# EAGLE schematic BpodMainBoard_r0_5 (EAGLE 6.3)
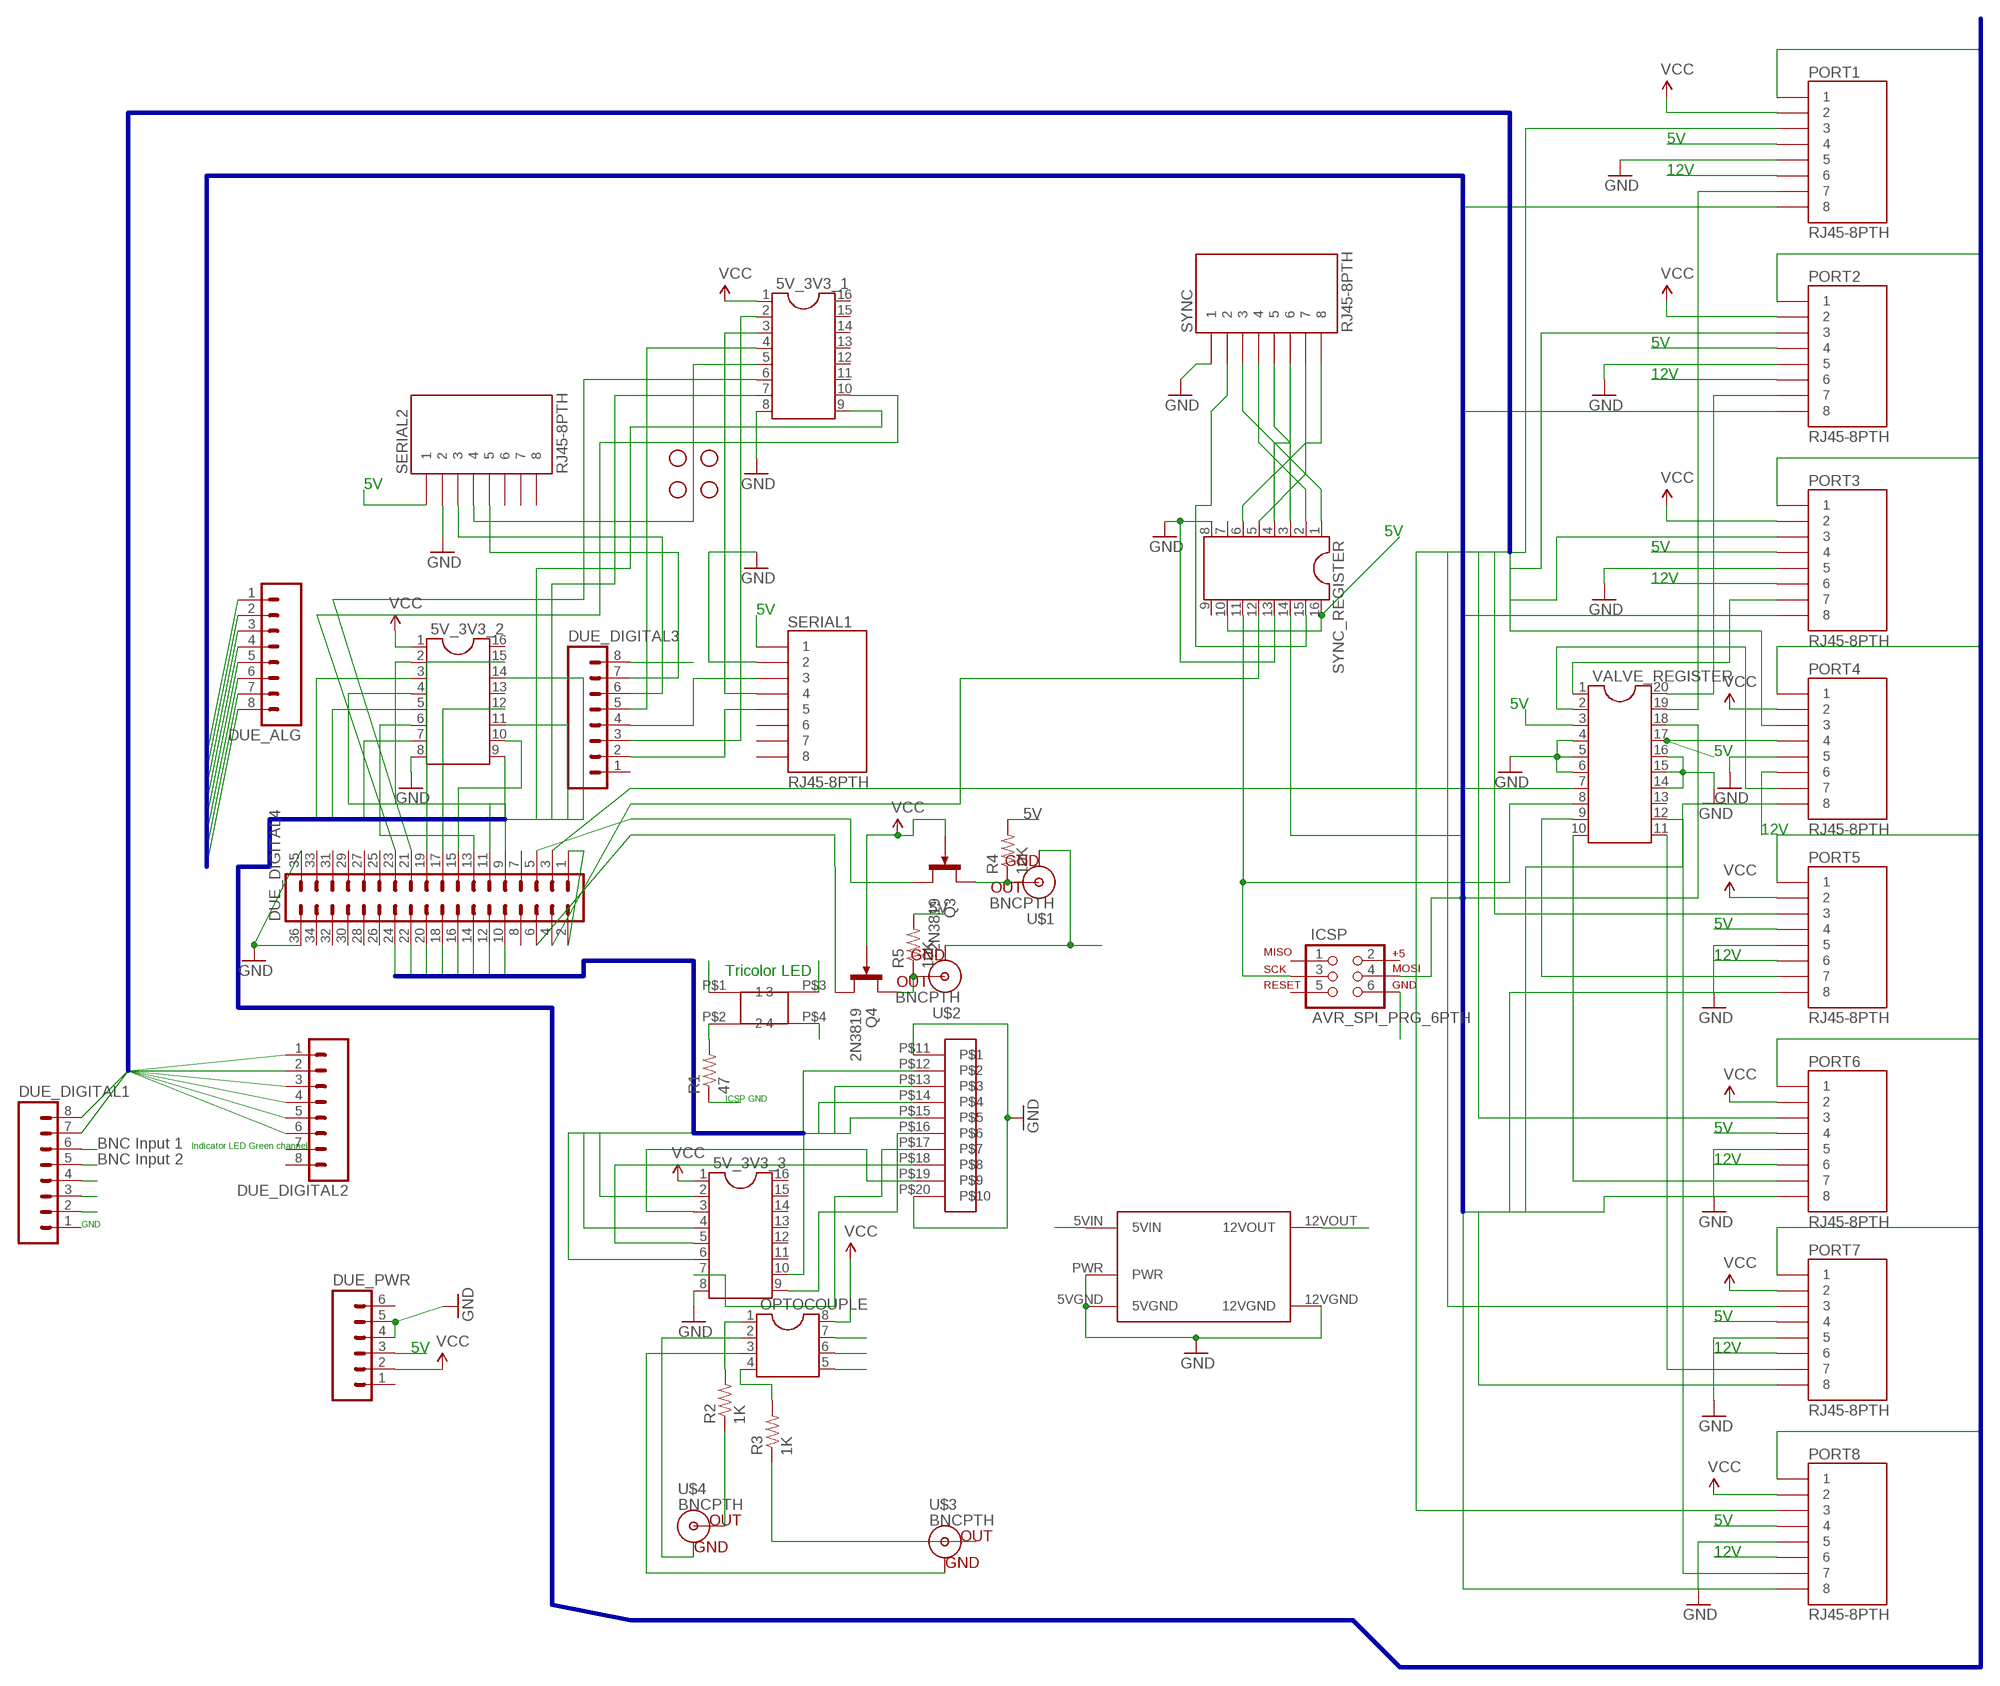
[diagram p0: schematic, sheet 1]

## Parts
5V_3V3_1  DIL16  [DIL16]
5V_3V3_2  DIL16  [DIL16]
5V_3V3_3  DIL16  [DIL16]
DUE_ALG  M081X08  [1X08]
DUE_DIGITAL1  M081X08  [1X08]
DUE_DIGITAL2  M081X08  [1X08]
DUE_DIGITAL3  M081X08  [1X08]
DUE_DIGITAL4  MA18-2  [MA18-2]
DUE_PWR  M06SIP  [1X06]
ICSP  AVR_SPI_PRG_6PTH  [2X3]
JP1  STAND-OFF  [STAND-OFF]
JP2  STAND-OFF  [STAND-OFF]
JP3  STAND-OFF  [STAND-OFF]
JP4  STAND-OFF  [STAND-OFF]
OPTOCOUPLE  DIL8  [DIL08]
PORT1  RJ45-8PTH  [RJ45-8]
PORT2  RJ45-8PTH  [RJ45-8]
PORT3  RJ45-8PTH  [RJ45-8]
PORT4  RJ45-8PTH  [RJ45-8]
PORT5  RJ45-8PTH  [RJ45-8]
PORT6  RJ45-8PTH  [RJ45-8]
PORT7  RJ45-8PTH  [RJ45-8]
PORT8  RJ45-8PTH  [RJ45-8]
Q3  2N3819  [TO92F]
Q4  2N3819  [TO92F]
R1  47  RESISTORAXIAL-0.3  [AXIAL-0.3]
R2  1K  RESISTORAXIAL-0.3  [AXIAL-0.3]
R3  1K  RESISTORAXIAL-0.3  [AXIAL-0.3]
R4  10K  RESISTORAXIAL-0.3  [AXIAL-0.3]
R5  10K  RESISTORAXIAL-0.3  [AXIAL-0.3]
SERIAL1  RJ45-8PTH  [RJ45-8]
SERIAL2  RJ45-8PTH  [RJ45-8]
SYNC  RJ45-8PTH  [RJ45-8]
SYNC_REGISTER  DIL16  [DIL16]
U$1  BNCPTH  [BNC]
U$2  BNCPTH  [BNC]
U$3  BNCPTH  [BNC]
U$4  BNCPTH  [BNC]
U$5  TDK_LAMBDA_5V_TO_12V  [TDK_LAMBDA_5V_12V]
U$6  10POS_SPRING_TERMINAL  [10POS_SCREW_TERMINAL]
U$8  SQUARE_TRICOLOR_LED  [SQUARE_TRICOLOR_LED]
VALVE_REGISTER  DIL20  [DIL20]

## Nets
5V: DUE_DIGITAL4.1 DUE_DIGITAL4.2 DUE_PWR.3 PORT1.4 PORT2.4 PORT3.4 PORT4.4 PORT5.4 PORT6.4 PORT7.4 PORT8.4 R4.P$2 R5.P$2 SERIAL1.1 SERIAL2.1 SYNC_REGISTER.10 SYNC_REGISTER.16 U$5.5VIN VALVE_REGISTER.3 VALVE_REGISTER.17
12V: PORT1.6 PORT2.6 PORT3.6 PORT4.6 PORT5.6 PORT6.6 PORT7.6 PORT8.6 U$5.12VOUT
ANALOG_BUS1: DUE_ALG.1 PORT1.8
ANALOG_BUS2: DUE_ALG.2 PORT2.8
ANALOG_BUS3: DUE_ALG.3 PORT3.8
ANALOG_BUS4: DUE_ALG.4 PORT4.8
ANALOG_BUS5: DUE_ALG.5 PORT5.8
ANALOG_BUS6: DUE_ALG.6 PORT6.8
ANALOG_BUS7: DUE_ALG.7 PORT7.8
ANALOG_BUS8: DUE_ALG.8 PORT8.8
BNCIN1: DUE_DIGITAL1.6 OPTOCOUPLE.7
BNCIN2: DUE_DIGITAL1.5 OPTOCOUPLE.6
DIGITAL_BUS1: 5V_3V3_2.3 PORT1.1
DIGITAL_BUS2: 5V_3V3_2.5 PORT2.1
DIGITAL_BUS3: 5V_3V3_2.7 PORT3.1
DIGITAL_BUS4: 5V_3V3_2.9 PORT4.1
DIGITAL_BUS5: 5V_3V3_2.11 PORT5.1
DIGITAL_BUS6: 5V_3V3_2.14 PORT6.1
DIGITAL_BUS7: 5V_3V3_1.7 PORT7.1
DIGITAL_BUS8: 5V_3V3_1.9 PORT8.1
DSUB_BUS1: 5V_3V3_3.2 DUE_DIGITAL4.10
DSUB_BUS2: 5V_3V3_3.4 DUE_DIGITAL4.12
DSUB_BUS3: 5V_3V3_3.6 DUE_DIGITAL4.14
DSUB_BUS4: 5V_3V3_3.10 DUE_DIGITAL4.16
DSUB_BUS5: DUE_DIGITAL4.18 U$6.P$15
DSUB_BUS6: DUE_DIGITAL4.20 U$6.P$14
DSUB_BUS7: DUE_DIGITAL4.22 U$6.P$13
DSUB_BUS8: DUE_DIGITAL4.24 U$6.P$12
GND: 5V_3V3_1.8 5V_3V3_2.8 5V_3V3_3.8 DUE_DIGITAL4.35 DUE_DIGITAL4.36 DUE_PWR.4 DUE_PWR.5 PORT1.5 PORT2.5 PORT3.5 PORT4.5 PORT5.5 PORT6.5 PORT7.5 PORT8.5 SERIAL1.2 SERIAL2.2 SYNC.1 SYNC_REGISTER.8 SYNC_REGISTER.13 U$5.5VGND U$5.12VGND U$5.PWR U$6.P$11 U$6.P$20 VALVE_REGISTER.4 VALVE_REGISTER.5 VALVE_REGISTER.6 VALVE_REGISTER.14 VALVE_REGISTER.15 VALVE_REGISTER.16
ICSP_GND: ICSP.6 R1.P$1
LED1: DUE_DIGITAL1.4 U$8.P$3
LED2: DUE_DIGITAL1.3 U$8.P$4
LED3: DUE_DIGITAL3.8 U$8.P$1
LED_BUS1: DUE_DIGITAL1.7 PORT1.3
LED_BUS2: DUE_DIGITAL1.8 PORT2.3
LED_BUS3: DUE_DIGITAL2.1 PORT3.3
LED_BUS4: DUE_DIGITAL2.2 PORT4.3
LED_BUS5: DUE_DIGITAL2.3 PORT5.3
LED_BUS6: DUE_DIGITAL2.4 PORT6.3
LED_BUS7: DUE_DIGITAL2.5 PORT7.3
LED_BUS8: DUE_DIGITAL2.6 PORT8.3
N$1: R2.P$1 U$4.S(OUT)
N$2: R3.P$1 U$3.S(OUT)
N$3: OPTOCOUPLE.1 R2.P$2
N$4: OPTOCOUPLE.4 R3.P$2
N$5: OPTOCOUPLE.2 U$4.GND
N$6: OPTOCOUPLE.3 U$3.GND
N$7: Q3.D R4.P$1 U$1.S(OUT)
N$8: Q4.D R5.P$1 U$2.S(OUT)
N$9: PORT1.7 VALVE_REGISTER.19
N$10: PORT2.7 VALVE_REGISTER.20
N$11: PORT3.7 VALVE_REGISTER.1
N$12: PORT4.7 VALVE_REGISTER.2
N$13: PORT5.7 VALVE_REGISTER.9
N$14: PORT6.7 VALVE_REGISTER.10
N$15: PORT7.7 VALVE_REGISTER.11
N$16: PORT8.7 VALVE_REGISTER.12
N$17: SYNC.2 SYNC_REGISTER.15
N$18: SYNC.3 SYNC_REGISTER.1
N$19: SYNC.4 SYNC_REGISTER.2
N$20: DUE_DIGITAL4.3 VALVE_REGISTER.7
N$21: SYNC.5 SYNC_REGISTER.3
N$22: SYNC.6 SYNC_REGISTER.4
N$23: SYNC.7 SYNC_REGISTER.5
N$24: SYNC.8 SYNC_REGISTER.6
N$25: R1.P$2 U$8.P$2
N$26: DUE_DIGITAL4.5 Q3.S
N$28: DUE_DIGITAL4.4 SYNC_REGISTER.12
N$29: DUE_DIGITAL4.6 Q4.S
N$32: 5V_3V3_1.3 SERIAL1.4
N$33: 5V_3V3_1.2 DUE_DIGITAL3.3
N$34: DUE_DIGITAL3.4 SERIAL1.3
N$35: 5V_3V3_1.5 SERIAL2.4
N$36: 5V_3V3_1.4 DUE_DIGITAL3.5
N$37: DUE_DIGITAL3.2 SERIAL1.5
N$39: 5V_3V3_1.6 DUE_DIGITAL4.21
N$40: DUE_DIGITAL3.6 SERIAL2.3
N$41: 5V_3V3_1.10 DUE_DIGITAL4.23
N$42: DUE_DIGITAL3.7 SERIAL2.5
N$43: 5V_3V3_2.2 DUE_DIGITAL4.9
N$44: 5V_3V3_2.4 DUE_DIGITAL4.11
N$45: 5V_3V3_2.6 DUE_DIGITAL4.13
N$46: 5V_3V3_2.10 DUE_DIGITAL4.15
N$47: 5V_3V3_2.12 DUE_DIGITAL4.17
N$48: 5V_3V3_2.15 DUE_DIGITAL4.19
N$49: 5V_3V3_3.3 U$6.P$19
N$50: 5V_3V3_3.5 U$6.P$18
N$51: 5V_3V3_3.7 U$6.P$17
N$52: 5V_3V3_3.9 U$6.P$16
SPI_CLK: ICSP.3 SYNC_REGISTER.11 VALVE_REGISTER.8
SPI_DATA: ICSP.4 SYNC_REGISTER.14 VALVE_REGISTER.18
UPPER_GND: DUE_DIGITAL1.2 OPTOCOUPLE.5 U$1.GND U$2.GND
VCC: 5V_3V3_1.1 5V_3V3_2.1 5V_3V3_3.1 DUE_PWR.2 OPTOCOUPLE.8 PORT1.2 PORT2.2 PORT3.2 PORT4.2 PORT5.2 PORT6.2 PORT7.2 PORT8.2 Q3.G Q4.G
Unconnected: 5V_3V3_1.11 5V_3V3_1.12 5V_3V3_1.13 5V_3V3_1.14 5V_3V3_1.15 5V_3V3_1.16 5V_3V3_2.13 5V_3V3_2.16 5V_3V3_3.11 5V_3V3_3.12 5V_3V3_3.13 5V_3V3_3.14 5V_3V3_3.15 5V_3V3_3.16 DUE_DIGITAL1.1 DUE_DIGITAL2.7 DUE_DIGITAL2.8 DUE_DIGITAL3.1 DUE_DIGITAL4.7 DUE_DIGITAL4.8 DUE_DIGITAL4.25 DUE_DIGITAL4.26 DUE_DIGITAL4.27 DUE_DIGITAL4.28 DUE_DIGITAL4.29 DUE_DIGITAL4.30 DUE_DIGITAL4.31 DUE_DIGITAL4.32 DUE_DIGITAL4.33 DUE_DIGITAL4.34 DUE_PWR.1 DUE_PWR.6 ICSP.1 ICSP.2 ICSP.5 SERIAL1.6 SERIAL1.7 SERIAL1.8 SERIAL2.6 SERIAL2.7 SERIAL2.8 SYNC_REGISTER.7 SYNC_REGISTER.9 VALVE_REGISTER.13

## Buses
LED_BUS[1..8]
DSUB_BUS[1..8]
ANALOG_BUS[1..8]
DIGITAL_BUS[1..8]

## Notes on the sheet
- 5V
- 12V
- 5V
- 12V
- 5V
- 5V
- 5V
- 12V
- 5V
- 5V
- 5V
- 5V
- 12V
- 5V
- 5V
- 12V
- Tricolor LED
- ICSP GND
- 5V
- BNC Input 1 | Indicator LED Green channel
- BNC Input 2 | 12V
- GND
- 5V
- 5V | 12V
- 5V
- 12V

## Library data of the parts
5V_3V3_1-5V_3V3_3 SYNC_REGISTER = ic-package:DIL16: Dual In Line / Socket
DUE_ALG DUE_DIGITAL1-DUE_DIGITAL3 = SparkFun:M08: Header 8 Standard 8-pin 0.1" header. Use with straight break away headers (SKU : PRT-00116), right angle break away headers (PRT-00553), swiss pins (PRT-00743), machine pins (PRT-00117), and female headers (PRT-00115).
DUE_DIGITAL4 = con-lstb:MA18-2: PIN HEADER
DUE_PWR = SparkFun:M06: Header 6 Standard 6-pin 0.1" header. Use with straight break away headers (SKU : PRT-00116), right angle break away headers (PRT-00553), swiss pins (PRT-00743), machine pins (PRT-00117), and female headers (PRT-00115). Molex polarized connector foot print use with SKU : PRT-08094 with associated crimp pins and housings. NOTES ON THE VARIANTS LOCK and LOCK_LONGPADS... This footprint was designed to help hold the alignment of a through-hole component (i.e. 6-pin header) while soldering it into place. You may notice that each hole has been shifted either up or down by 0.005 of an inch from it's more standard position (which is a perfectly straight line). This slight alteration caused the pins (the squares in the middle) to touch the edges of the holes. Because they are alternating, it causes a "brace" to hold the component in place. 0.005 has proven to be the perfect amount of "off-center" position when using our standard breakaway headers. Although looks a little odd when you look at the bare footprint, once you have a header in there, the alteration is very hard to notice. Also, if you push a header all the way into place, it is covered up entirely on the bottom side. This idea of altering the position of holes to aid alignment will be further integrated into the Sparkfun Library for other footprints. It can help hold any component with 3 or more connection pins.
ICSP = SparkFun:AVR_SPI_PRG_6: AVR ISP 6 Pin This is the reduced ISP connector for AVR programming. Common on Arduino. This footprint will take up less PCB space and can be used with a 10-pin to 6-pin adapter such as SKU: BOB-08508
JP1-JP4 = SparkFun:STAND-OFF: Stand Off This is the mechanical footprint for a #4 phillips button head screw. Use the keepout ring to avoid running the screw head into surrounding components. SKU : PRT-00447
OPTOCOUPLE = ic-package:DIL8: Dual In Line / Socket
PORT1-PORT8 SERIAL1 SERIAL2 SYNC = SparkFun:RJ45-8: RJ45 Jack Simple RJ45, 8-pin connection - connector for common Cat5, Cat5e, and Cat6 Ethernet cables. Footprint not yet proven in production. Connector sku is PRT-00643; Breakout PCB sku is BOB-00716.
Q3 Q4 = transistor-small-signal:2N3819: N-CHANNEL FET
R1 = SparkFun-Passives:RESISTOR: Resistor Basic schematic elements and footprints for 0603, 1206, and PTH resistors.
R2-R5 = SparkFun:RESISTOR: Resistor Basic schematic elements and footprints for 0603, 1206, and PTH resistors.
U$1-U$4 = SparkFun:BNC: BNC Connector, Mouser Part# 5227161
U$5 = JoshParts:TDK_LAMBDA_5V_TO_12V
U$6 = JoshParts:10POS_SPRING_TERMINAL
U$8 = JoshParts:SQUARE_TRICOLOR_LED
VALVE_REGISTER = ic-package:DIL20: Dual In Line / Socket

## Net classes
0 default: width 0.254 mm, clearance 0.254 mm